# EAGLE design RGB LED Board -- Breadboard Version -- Single (EAGLE 6.4)
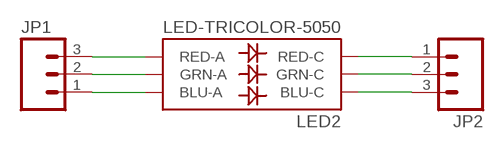
[diagram p0: schematic, sheet 1]

## Parts
JP1  M03PTH  [1X03]
JP2  M03PTH  [1X03]
LED2  LED-TRICOLOR-5050  [LED-TRICOLOR-5050]

## Nets
N$1: JP1.1 LED2.3(BLU-A)
N$2: JP1.2 LED2.1(GRN-A)
N$3: JP1.3 LED2.2(RED-A)
N$4: JP2.1 LED2.5(RED-C)
N$5: JP2.2 LED2.6(GRN-C)
N$6: JP2.3 LED2.4(BLU-C)

## Library data of the parts
JP1 JP2 = SparkFun:M03: Header 3 Standard 3-pin 0.1" header. Use with straight break away headers (SKU : PRT-00116), right angle break away headers (PRT-00553), swiss pins (PRT-00743), machine pins (PRT-00117), and female headers (PRT-00115). Molex polarized connector foot print use with SKU : PRT-08232 with associated crimp pins and housings.
LED2 = SparkFun:LED-TRICOLOR-5050

## Board
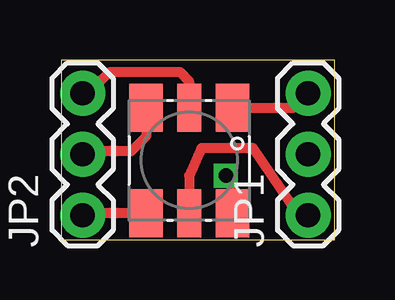
[diagram p1: board, top side]
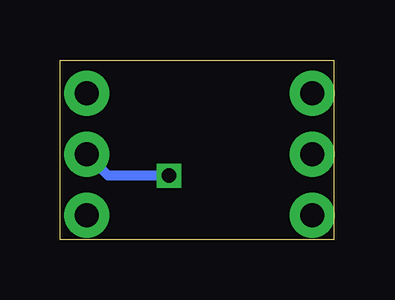
[diagram p2: board, bottom side, seen from below]

Size 11.4 x 7.48 mm. Coordinates in mm from the lower left corner, seen from the top.
Outline: 0,0 11.4,0 11.4,7.48 0,7.48 0,0
Copper layers (1*16): Top 0.035mm / dielectric 1.5mm / Bottom 0.035mm
Design rules "default": minimum track width 10mil, minimum drill 24mil, track to track 8mil, track to pad 8mil, pad to pad 8mil, via to via 8mil, smd to smd 8mil, copper to edge 40mil, drill to drill 8mil, minimum pad ring 10mil, minimum via ring 8mil, stop-mask expansion 4mil, vias tented up to drill 0mil, thermal gap 10mil

### Footprints (pad centres in the part's own frame; a part is rotated, then mirrored left to right if it is on the bottom)
1X03 = drill 1.016 pad 1.88: 1 0,0; 2 2.54,0; 3 5.08,0
LED-TRICOLOR-5050 = smd 2 x 1.4: 1 2.2,1.8; 2 -2.2,1.8; 5 2.2,-1.8; 6 -2.2,-1.8 | smd 2 x 1: 3 2.2,0; 4 -2.2,0

### Placement (x,y rotation side)
JP1  10.29,1.02 90 top
JP2  0.89,1.02 90 top
LED2  5.33,3.3 270 top

### Tracks (layer width: path | path; a pad name or v marks a point on that pad's centre or on a via)
N$1
  Top 0.406: JP1.1 9.91,1.02 8,3.81 5.84,3.81 5.33,2.67 LED2.3
N$2  (via drill 0.6)
  Top 0.406: LED2.1 7.13,2.39 v6.86,2.67
  Bottom 0.406: v6.86,2.67 9.4,2.67 JP1.2
N$3
  Top 0.406: LED2.2 9.69,5.5 JP1.3
N$4
  Top 0.406: LED2.5 0.89,1.1 JP2.1
N$5
  Top 0.406: LED2.6 3.53,4.3 2.92,3.68 1.02,3.68 JP2.2
N$6
  Top 0.406: JP2.3 1.14,6.1 2.03,6.99 4.95,6.99 5.33,6.6 LED2.4